# EAGLE design NAND-X QSB Board A (EAGLE 9.6.2)
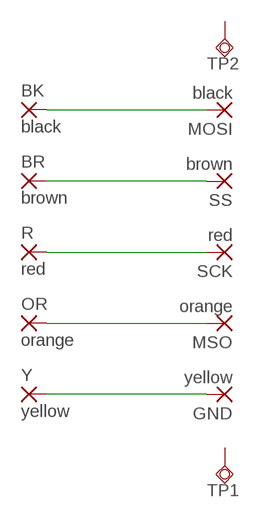
[diagram p0: schematic, sheet 1]

## Parts
BK  black  1,6/0,8  [1,6/0,8]
BR  brown  1,6/0,8  [1,6/0,8]
GND  yellow  SMD2  [SMD1,27-2,54]
MOSI  black  SMD2  [SMD1,27-2,54]
MSO  orange  SMD2  [SMD1,27-2,54]
OR  orange  1,6/0,8  [1,6/0,8]
R  red  1,6/0,8  [1,6/0,8]
SCK  red  SMD2  [SMD1,27-2,54]
SS  brown  SMD2  [SMD1,27-2,54]
TP1  TPSQTP11SQ  [TP11SQ]
TP2  TPSQTP11SQ  [TP11SQ]
Y  yellow  1,6/0,8  [1,6/0,8]

## Nets
N$1: R.1(P) SCK.1(P)
N$2: MSO.1(P) OR.1(P)
N$3: BR.1(P) SS.1(P)
N$4: GND.1(P) Y.1(P)
N$5: BK.1(P) MOSI.1(P)
Unconnected: TP1.TP TP2.TP

## Library data of the parts
BK BR OR R Y = wirepad:1,6/0,8: THROUGH-HOLE PAD
GND MOSI MSO SCK SS = wirepad:SMD2: SMD PAD
TP1 TP2 = testpad:TPSQ: Test pad

## Board
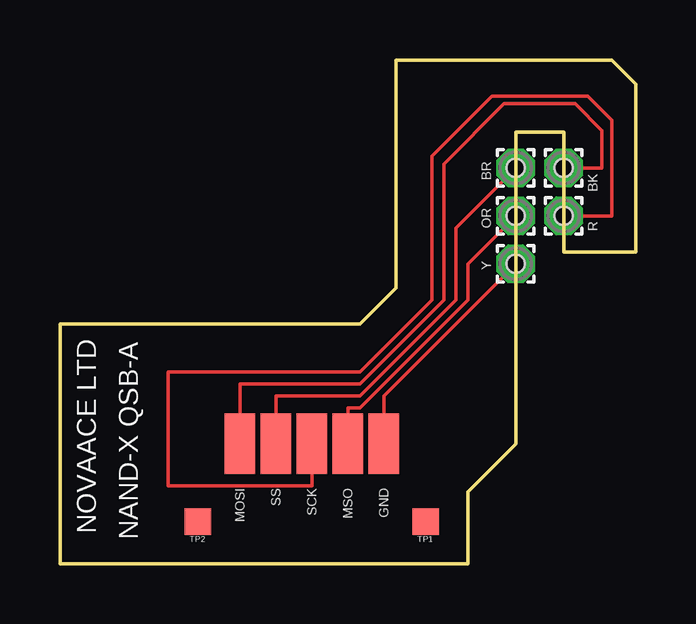
[diagram p1: board, top side]

Size 24 x 21 mm. Coordinates in mm from the lower left corner, seen from the top.
Outline: 0,10 0,0 17,0 17,3 19,5 19,18 21,18 21,13 24,13 24,20 23,21 14,21 14,11.5 12.5,10 0,10
Copper layers (1*16): Top 0.035mm / dielectric 1.5mm / Bottom 0.035mm
Design rules "default": minimum track width 6mil, minimum drill 0.35mm, track to track 6mil, track to pad 6mil, pad to pad 6mil, via to via 6mil, smd to smd 6mil, copper to edge 40mil, drill to drill 6mil, minimum pad ring 10mil, minimum via ring 8mil, stop-mask expansion 4mil, vias tented up to drill 0mil, thermal gap 10mil
Holes 0.75 mm at 19,14.5 19,12.5 21,14.5 21,16.5 19,16.5

### Footprints (pad centres in the part's own frame; a part is rotated, then mirrored left to right if it is on the bottom)
1,6/0,8 = drill 0.813 pad 1.6 octagon: 1 0,0
SMD1,27-2,54 = smd 1.27 x 2.54: 1 0,0
TP11SQ = smd 1.1 x 1.1: TP 0,0

### Placement (x,y rotation side)
BK  21,16.5 0 top
BR  19,16.5 0 top
GND  13.5,5 0 top
MOSI  7.5,5 0 top
MSO  12,5 0 top
OR  19,14.5 0 top
R  21,14.5 0 top
SCK  10.5,5 0 top
SS  9,5 0 top
TP1  15.25,1.75 0 top
TP2  5.75,1.75 0 top
Y  19,12.5 0 top

### Tracks (layer width: path | path; a pad name or v marks a point on that pad's centre or on a via)
N$1
  Top 0.152: R.1 23,14.5 23,18.5 22,19.5 18,19.5 15.5,17 15.5,11 12.5,8 4.5,8 4.5,3.25 10.5,3.25 SCK.1
N$2
  Top 0.152: OR.1 17,12.5 17,11 12.5,6.5 12,6.5 MSO.1
N$3
  Top 0.152: BR.1 16.5,14 16.5,11 12.5,7 9,7 SS.1
N$4
  Top 0.152: GND.1 13.5,7 Y.1
N$5
  Top 0.152: BK.1 22.59,16.5 22.59,18.06 21.48,19.17 18.52,19.17 16,16.65 16,11 12.5,7.5 7.5,7.5 MOSI.1

### Text on the board
tNames: NOVAACE LTD | NAND-X QSB-A
bNames: POINT TOWARDS | MOTHERBOARD